# EAGLE schematic TMC5130_3D_Printer_BOARD_V_2 (EAGLE 6.5.0)

## Sheet 1 of 6: I/O
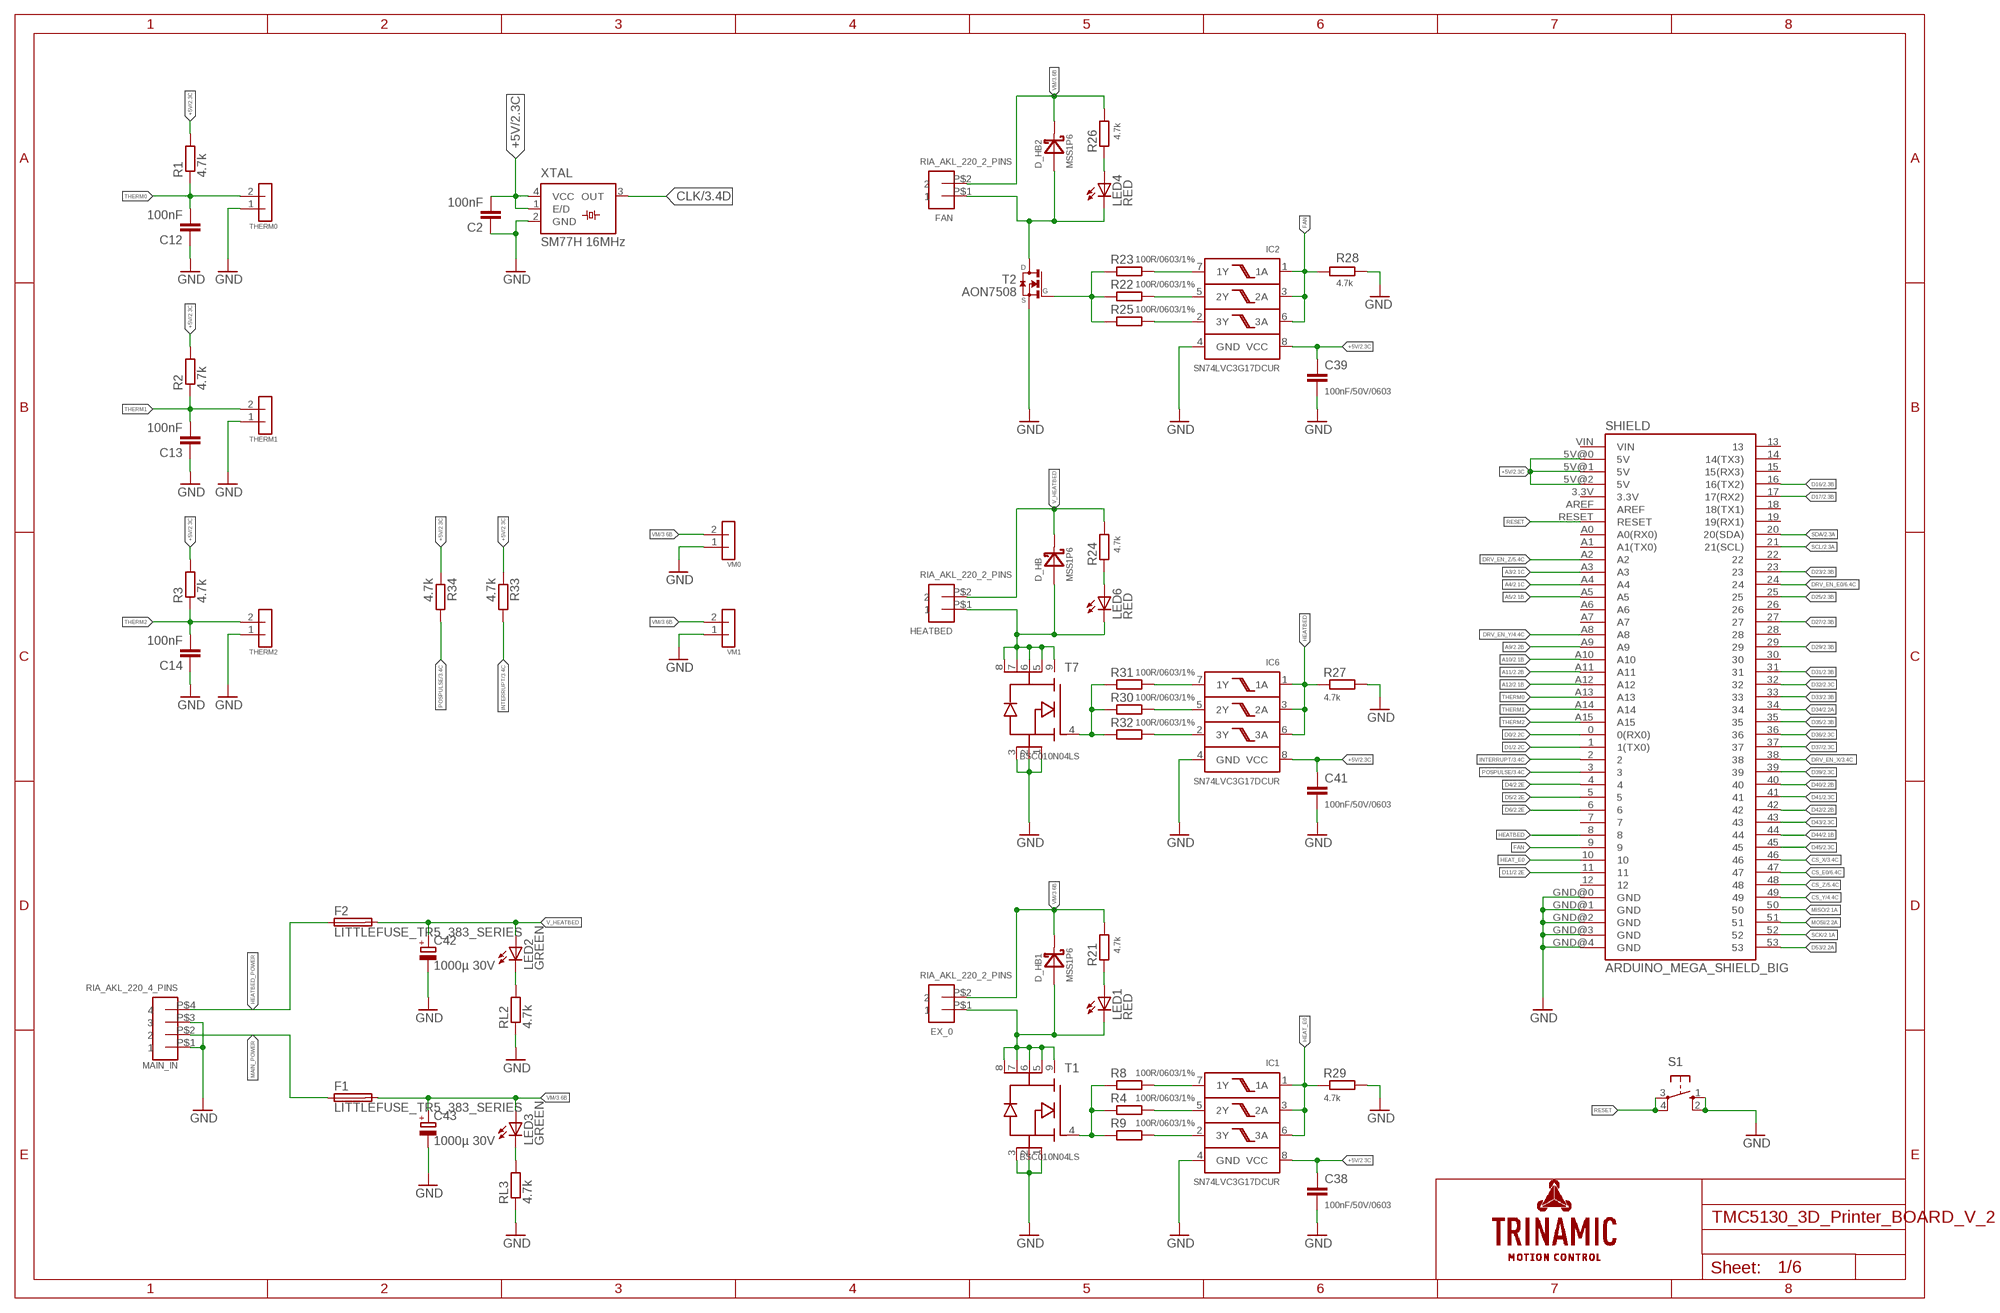
[diagram p0: schematic, sheet 1]

### Parts
C2  100nF  C-EUC0603  [C0603]
C12  100nF  C-EUC0603  [C0603]
C13  100nF  C-EUC0603  [C0603]
C14  100nF  C-EUC0603  [C0603]
C38  100nF/50V/0603  C-EUC0603  [C0603]
C39  100nF/50V/0603  C-EUC0603  [C0603]
C41  100nF/50V/0603  C-EUC0603  [C0603]
C42  1000µ 30V  CPOL-EUE5-10.5  [E5-10,5]
C43  1000µ 30V  CPOL-EUE5-10.5  [E5-10,5]
D_HB  MSS1P6  [MICRO_SMP]
D_HB1  MSS1P6  [MICRO_SMP]
D_HB2  MSS1P6  [MICRO_SMP]
EX_0  RIA_AKL_220_2_PINS  [RIA_AKL_220_2_PINS]
F1  LITTLEFUSE_TR5_383_SERIES  [LITTLEFUSE_TR5_383_SERIES]
F2  LITTLEFUSE_TR5_383_SERIES  [LITTLEFUSE_TR5_383_SERIES]
FAN  RIA_AKL_220_2_PINS  [RIA_AKL_220_2_PINS]
HEATBED  RIA_AKL_220_2_PINS  [RIA_AKL_220_2_PINS]
IC1  SN74LVC3G17DCUR  [US8_DCU]
IC2  SN74LVC3G17DCUR  [US8_DCU]
IC6  SN74LVC3G17DCUR  [US8_DCU]
LED1  RED  LEDCHIPLED_0603  [CHIPLED_0603]
LED2  GREEN  LEDCHIPLED_0603  [CHIPLED_0603]
LED3  GREEN  LEDCHIPLED_0603  [CHIPLED_0603]
LED4  RED  LEDCHIPLED_0603  [CHIPLED_0603]
LED6  RED  LEDCHIPLED_0603  [CHIPLED_0603]
MAIN_IN  RIA_AKL_220_4_PINS  [RIA_AKL_220_4_PINS]
R1  4.7k  R-EU_R0603  [R0603]
R2  4.7k  R-EU_R0603  [R0603]
R3  4.7k  R-EU_R0603  [R0603]
R4  100R/0603/1%  R-EU_R0603  [R0603]
R8  100R/0603/1%  R-EU_R0603  [R0603]
R9  100R/0603/1%  R-EU_R0603  [R0603]
R21  4.7k  R-EU_R0603  [R0603]
R22  100R/0603/1%  R-EU_R0603  [R0603]
R23  100R/0603/1%  R-EU_R0603  [R0603]
R24  4.7k  R-EU_R0603  [R0603]
R25  100R/0603/1%  R-EU_R0603  [R0603]
R26  4.7k  R-EU_R0603  [R0603]
R27  4.7k  R-EU_R0603  [R0603]
R28  4.7k  R-EU_R0603  [R0603]
R29  4.7k  R-EU_R0603  [R0603]
R30  100R/0603/1%  R-EU_R0603  [R0603]
R31  100R/0603/1%  R-EU_R0603  [R0603]
R32  100R/0603/1%  R-EU_R0603  [R0603]
R33  4.7k  R-EU_R0603  [R0603]
R34  4.7k  R-EU_R0603  [R0603]
RL2  4.7k  R-EU_R0603  [R0603]
RL3  4.7k  R-EU_R0603  [R0603]
S1  10-XX  [B3F-10XX]
SHIELD  ARDUINO_MEGA_SHIELD_BIG  [ARDUINO_MEGA_SHIELD]
T1  BSC010N04LS  [PG-TDSON-8FL]
T2  AON7508  [DFN3X3_8L]
T7  BSC010N04LS  [PG-TDSON-8FL]
THERM0  2PIN_1ROW  [2PIN_1ROW_2.54_THT]
THERM1  2PIN_1ROW  [2PIN_1ROW_2.54_THT]
THERM2  2PIN_1ROW  [2PIN_1ROW_2.54_THT]
VM0  2PIN_1ROW  [2PIN_1ROW_2.54_THT]
VM1  2PIN_1ROW  [2PIN_1ROW_2.54_THT]
XTAL  SM77H 16MHz  SM77H  [SM77H]

### Nets
+5V: C2.2 C38.1 C39.1 C41.1 IC1.8(VCC) IC2.8(VCC) IC6.8(VCC) R1.2 R2.2 R3.2 R33.1 R34.1 SHIELD.5V@0(5V) SHIELD.5V@1(5V) SHIELD.5V@2(5V) XTAL.1(E/D) XTAL.4(VCC) ; also sheet 2,3,4,5,6
A3: SHIELD.A3 ; also sheet 2
A4: SHIELD.A4 ; also sheet 2
A5: SHIELD.A5 ; also sheet 2
A9: SHIELD.A9 ; also sheet 2
A10: SHIELD.A10 ; also sheet 2
A11: SHIELD.A11 ; also sheet 2
A12: SHIELD.A12 ; also sheet 2
CLK: XTAL.3(OUT) ; also sheet 3,4,5,6
CS_E0: SHIELD.47 ; also sheet 6
CS_X: SHIELD.46 ; also sheet 3
CS_Y: SHIELD.49 ; also sheet 4
CS_Z: SHIELD.48 ; also sheet 5
D0: SHIELD.0(0(RX0)) ; also sheet 2
D1: SHIELD.1(1(TX0)) ; also sheet 2
D4: SHIELD.4 ; also sheet 2
D5: SHIELD.5 ; also sheet 2
D6: SHIELD.6 ; also sheet 2
D11: SHIELD.11 ; also sheet 2
D16: SHIELD.16(16(TX2)) ; also sheet 2
D17: SHIELD.17(17(RX2)) ; also sheet 2
D23: SHIELD.23 ; also sheet 2
D25: SHIELD.25 ; also sheet 2
D27: SHIELD.27 ; also sheet 2
D29: SHIELD.29 ; also sheet 2
D31: SHIELD.31 ; also sheet 2
D32: SHIELD.32 ; also sheet 2
D33: SHIELD.33 ; also sheet 2
D34: SHIELD.34 ; also sheet 2
D35: SHIELD.35 ; also sheet 2
D36: SHIELD.36 ; also sheet 2
D37: SHIELD.37 ; also sheet 2
D39: SHIELD.39 ; also sheet 2
D40: SHIELD.40 ; also sheet 2
D41: SHIELD.41 ; also sheet 2
D42: SHIELD.42 ; also sheet 2
D43: SHIELD.43 ; also sheet 2
D44: SHIELD.44 ; also sheet 2
D45: SHIELD.45 ; also sheet 2
D53: SHIELD.53 ; also sheet 2
DRV_EN_E0: SHIELD.24 ; also sheet 6
DRV_EN_X: SHIELD.38 ; also sheet 3
DRV_EN_Y: SHIELD.A8 ; also sheet 4
DRV_EN_Z: SHIELD.A2 ; also sheet 5
FAN: IC2.1(1A) IC2.3(2A) IC2.6(3A) R28.1 SHIELD.9
GND: C2.1 C12.1 C13.1 C14.1 C38.2 C39.2 C41.2 C42.- C43.- IC1.4(GND) IC2.4(GND) IC6.4(GND) MAIN_IN.P$1 MAIN_IN.P$3 R27.2 R28.2 R29.2 RL2.1 RL3.1 S1.1(S) S1.2(S1) SHIELD.GND@0(GND) SHIELD.GND@1(GND) SHIELD.GND@2(GND) SHIELD.GND@3(GND) SHIELD.GND@4(GND) T1.1 T1.2 T1.3 T2.S0(S) T2.S1(S) T2.S2(S) T7.1 T7.2 T7.3 THERM0.1 THERM1.1 THERM2.1 VM0.1 VM1.1 XTAL.2(GND) ; also sheet 2,3,4,5,6
HEAT_E0: IC1.1(1A) IC1.3(2A) IC1.6(3A) R29.1 SHIELD.10
HEATBED: IC6.1(1A) IC6.3(2A) IC6.6(3A) R27.1 SHIELD.8
HEATBED_POWER: F2.P$1 MAIN_IN.P$4
INTERRUPT: R33.2 SHIELD.2 ; also sheet 3,4,5,6
MAIN_POWER: F1.P$1 MAIN_IN.P$2
MISO: SHIELD.50 ; also sheet 2,3,4,5,6
MOSI: SHIELD.51 ; also sheet 2,3,4,5,6
N$24: LED3.C RL3.2
N$25: LED2.C RL2.2
N$26: LED6.A R24.1
N$27: D_HB1.A EX_0.P$1 LED1.C T1.5 T1.6 T1.7 T1.8 T1.9
N$28: R4.1 R8.1 R9.1 T1.4
N$29: IC1.7(1Y) R8.2
N$30: IC1.5(2Y) R4.2
N$31: IC1.2(3Y) R9.2
N$32: LED1.A R21.1
N$36: D_HB2.A FAN.P$1 LED4.C T2.D0(D) T2.D1(D) T2.D2(D) T2.D3(D) T2.D4(D) T2.D5(D) T2.D6(D)
N$37: R22.1 R23.1 R25.1 T2.G
N$38: D_HB.A HEATBED.P$1 LED6.C T7.5 T7.6 T7.7 T7.8 T7.9
N$39: R30.1 R31.1 R32.1 T7.4
N$40: IC2.7(1Y) R23.2
N$41: IC2.5(2Y) R22.2
N$42: IC6.7(1Y) R31.2
N$43: IC6.5(2Y) R30.2
N$44: IC6.2(3Y) R32.2
N$45: IC2.2(3Y) R25.2
N$46: LED4.A R26.1
POSPULSE: R34.2 SHIELD.3 ; also sheet 3,4,5,6
RESET: S1.3(P) S1.4(P1) SHIELD.RESET
SCK: SHIELD.52 ; also sheet 2,3,4,5,6
SCL: SHIELD.21(21(SCL)) ; also sheet 2
SDA: SHIELD.20(20(SDA)) ; also sheet 2
THERM0: C12.2 R1.1 SHIELD.A13 THERM0.2
THERM1: C13.2 R2.1 SHIELD.A14 THERM1.2
THERM2: C14.2 R3.1 SHIELD.A15 THERM2.2
V_HEATBED: C42.+ D_HB.C F2.P$2 HEATBED.P$2 LED2.A R24.2
VM: C43.+ D_HB1.C D_HB2.C EX_0.P$2 F1.P$2 FAN.P$2 LED3.A R21.2 R26.2 VM0.2 VM1.2 ; also sheet 3,4,5,6
Unconnected: SHIELD.3.3V SHIELD.7 SHIELD.12 SHIELD.13 SHIELD.14(14(TX3)) SHIELD.15(15(RX3)) SHIELD.18(18(TX1)) SHIELD.19(19(RX1)) SHIELD.22 SHIELD.26 SHIELD.28 SHIELD.30 SHIELD.A0(A0(RX0)) SHIELD.A1(A1(TX0)) SHIELD.A6 SHIELD.A7 SHIELD.AREF SHIELD.VIN

## Sheet 2 of 6
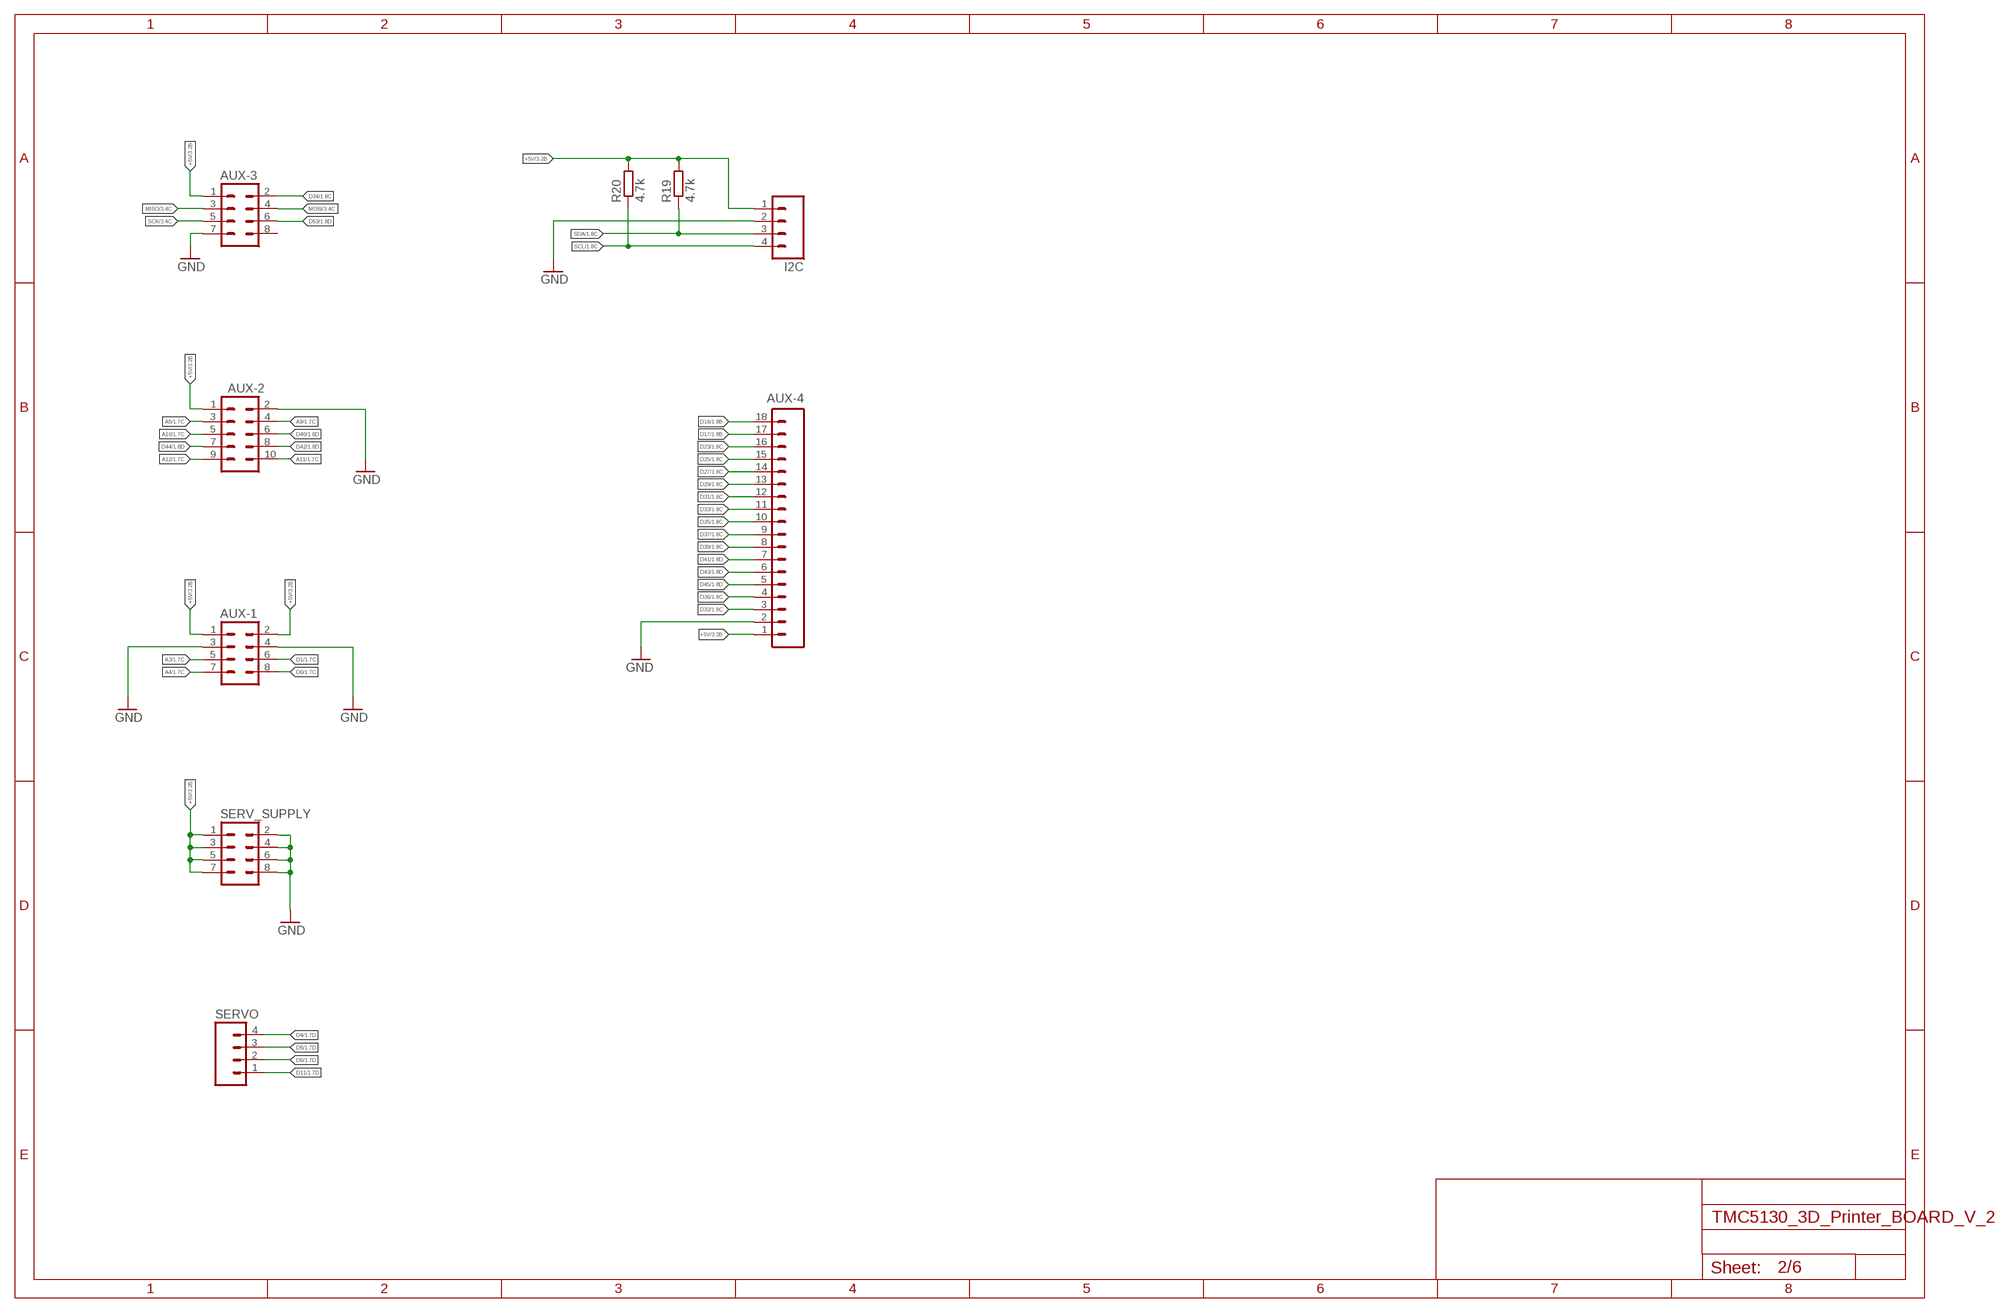
[diagram p1: schematic, sheet 2]

### Parts
AUX-1  M04X2  [2X4]
AUX-2  M05X2PTH  [AVR_ICSP]
AUX-3  M04X2  [2X4]
AUX-4  M18_  [1X18]
I2C  M04PTH  [1X04]
R19  4.7k  R-EU_R0603  [R0603]
R20  4.7k  R-EU_R0603  [R0603]
SERV_SUPPLY  M04X2  [2X4]
SERVO  M04PTH  [1X04]

### Nets
+5V: AUX-1.1 AUX-1.2 AUX-2.1 AUX-3.1 AUX-4.1 I2C.1 R19.2 R20.2 SERV_SUPPLY.1 SERV_SUPPLY.3 SERV_SUPPLY.5 SERV_SUPPLY.7 ; also sheet 1,3,4,5,6
A3: AUX-1.5 ; also sheet 1
A4: AUX-1.7 ; also sheet 1
A5: AUX-2.3 ; also sheet 1
A9: AUX-2.4 ; also sheet 1
A10: AUX-2.5 ; also sheet 1
A11: AUX-2.10 ; also sheet 1
A12: AUX-2.9 ; also sheet 1
D0: AUX-1.8 ; also sheet 1
D1: AUX-1.6 ; also sheet 1
D4: SERVO.4 ; also sheet 1
D5: SERVO.3 ; also sheet 1
D6: SERVO.2 ; also sheet 1
D11: SERVO.1 ; also sheet 1
D16: AUX-4.18 ; also sheet 1
D17: AUX-4.17 ; also sheet 1
D23: AUX-4.16 ; also sheet 1
D25: AUX-4.15 ; also sheet 1
D27: AUX-4.14 ; also sheet 1
D29: AUX-4.13 ; also sheet 1
D31: AUX-4.12 ; also sheet 1
D32: AUX-4.3 ; also sheet 1
D33: AUX-4.11 ; also sheet 1
D34: AUX-3.2 ; also sheet 1
D35: AUX-4.10 ; also sheet 1
D36: AUX-4.4 ; also sheet 1
D37: AUX-4.9 ; also sheet 1
D39: AUX-4.8 ; also sheet 1
D40: AUX-2.6 ; also sheet 1
D41: AUX-4.7 ; also sheet 1
D42: AUX-2.8 ; also sheet 1
D43: AUX-4.6 ; also sheet 1
D44: AUX-2.7 ; also sheet 1
D45: AUX-4.5 ; also sheet 1
D53: AUX-3.6 ; also sheet 1
GND: AUX-1.3 AUX-1.4 AUX-2.2 AUX-3.7 AUX-4.2 I2C.2 SERV_SUPPLY.2 SERV_SUPPLY.4 SERV_SUPPLY.6 SERV_SUPPLY.8 ; also sheet 1,3,4,5,6
MISO: AUX-3.3 ; also sheet 1,3,4,5,6
MOSI: AUX-3.4 ; also sheet 1,3,4,5,6
SCK: AUX-3.5 ; also sheet 1,3,4,5,6
SCL: I2C.4 R20.1 ; also sheet 1
SDA: I2C.3 R19.1 ; also sheet 1
Unconnected: AUX-3.8

## Sheet 3 of 6: X_AXIS
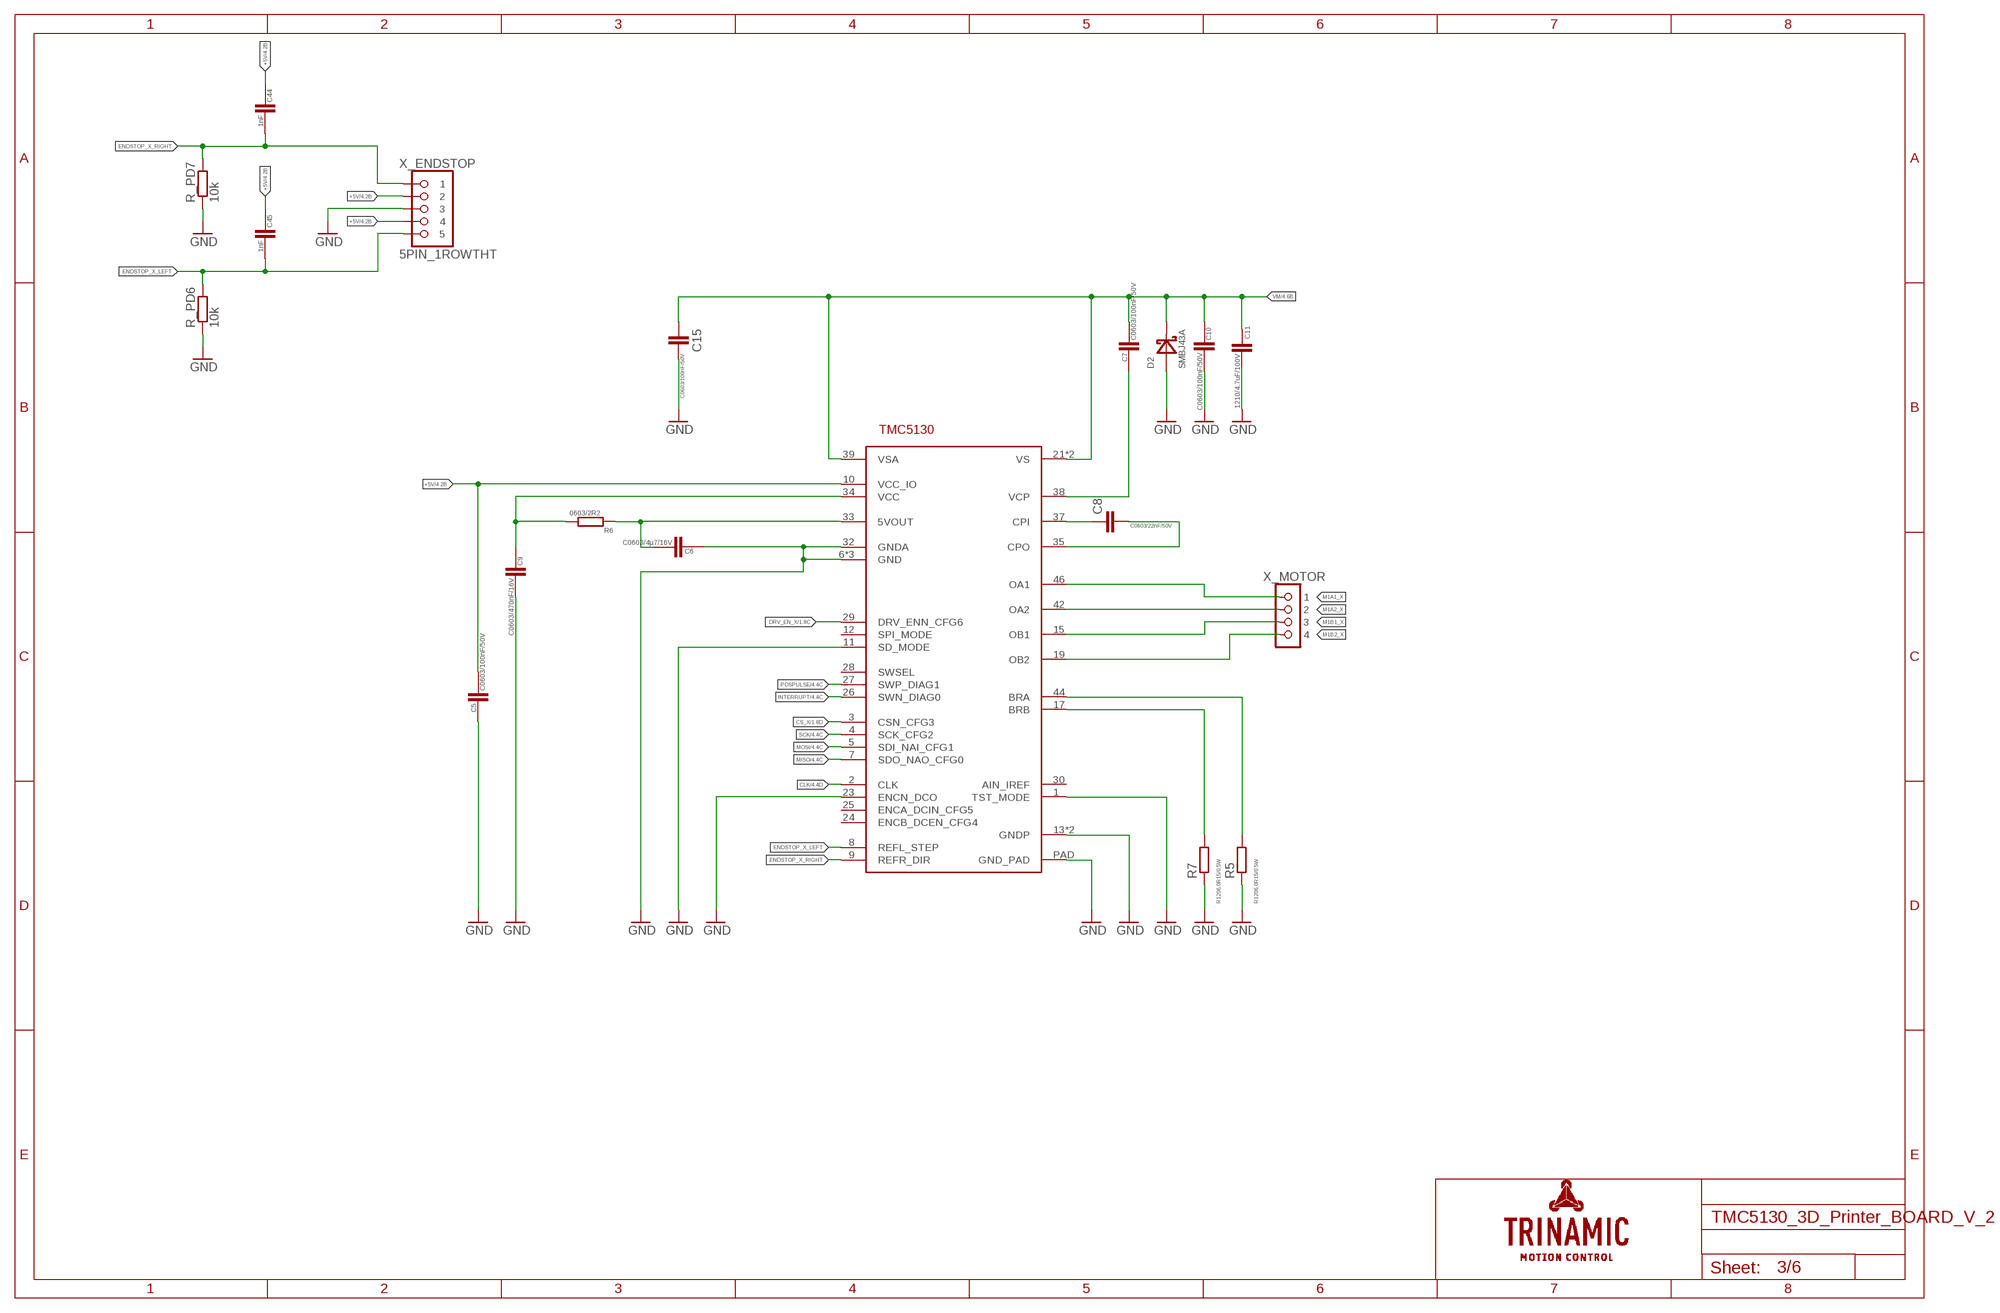
[diagram p2: schematic, sheet 3]

### Parts
C5  C0603/100nF/50V  C/0603  [0603]
C6  C0603/4µ7/16V  C/0603  [0603]
C7  C0603/100nF/50V  C/0603  [0603]
C8  C0603/22nF/50V  C-EUC0603  [C0603]
C9  C0603/470nF/16V  C/0603  [0603]
C10  C0603/100nF/50V  C/0603  [0603]
C11  1210/4.7uF/100V  C-EUC1210  [C1210]
C15  C0603/100nF/50V  C-EUC0603  [C0603]
C44  1nF  C/0603  [0603]
C45  1nF  C/0603  [0603]
D2  SMBJ43A  SMBJ  [SMB]
R5  R1206,0R15/0.5W  R-EU_R1206  [R1206]
R6  0603/2R2  R/0603  [0603]
R7  R1206,0R15/0.5W  R-EU_R1206  [R1206]
R_PD6  10k  R-EU_R0603  [R0603]
R_PD7  10k  R-EU_R0603  [R0603]
TMC5130  TMC5130  [QFP50P900X900X113-49N_NOFID]
X_ENDSTOP  5PIN_1ROWTHT  [5PIN_1ROW_2.54_THT]
X_MOTOR  4PIN_1ROWTHT  [4PIN_1ROW_2.54_THT]

### Nets
+5V: C5.1 C44.2 C45.2 TMC5130.10(VCC_IO) X_ENDSTOP.2 X_ENDSTOP.4 ; also sheet 1,2,4,5,6
CLK: TMC5130.2(CLK) ; also sheet 1,4,5,6
CS_X: TMC5130.3(CSN_CFG3) ; also sheet 1
DRV_EN_X: TMC5130.29(DRV_ENN_CFG6) ; also sheet 1
ENDSTOP_X_LEFT: C45.1 R_PD6.2 TMC5130.8(REFL_STEP) X_ENDSTOP.5
ENDSTOP_X_RIGHT: C44.1 R_PD7.2 TMC5130.9(REFR_DIR) X_ENDSTOP.1
GND: C5.2 C6.2 C9.1 C10.1 C11.2 C15.1 D2.A R5.1 R7.1 R_PD6.1 R_PD7.1 TMC5130.1(TST_MODE) TMC5130.6(GND) TMC5130.11(SD_MODE) TMC5130.13(GNDP) TMC5130.23(ENCN_DCO) TMC5130.31(GND) TMC5130.32(GNDA) TMC5130.36(GND) TMC5130.48(GNDP) TMC5130.PAD(GND_PAD) X_ENDSTOP.3 ; also sheet 1,2,4,5,6
INTERRUPT: TMC5130.26(SWN_DIAG0) ; also sheet 1,4,5,6
M1A1_X: TMC5130.46(OA1) X_MOTOR.1
M1A2_X: TMC5130.42(OA2) X_MOTOR.2
M1B1_X: TMC5130.15(OB1) X_MOTOR.3
M1B2_X: TMC5130.19(OB2) X_MOTOR.4
MISO: TMC5130.7(SDO_NAO_CFG0) ; also sheet 1,2,4,5,6
MOSI: TMC5130.5(SDI_NAI_CFG1) ; also sheet 1,2,4,5,6
N$7: C6.1 R6.1 TMC5130.33(5VOUT)
N$8: C8.1 TMC5130.37(CPI)
N$9: C8.2 TMC5130.35(CPO)
N$10: C7.2 TMC5130.38(VCP)
N$11: C9.2 R6.2 TMC5130.34(VCC)
POSPULSE: TMC5130.27(SWP_DIAG1) ; also sheet 1,4,5,6
SCK: TMC5130.4(SCK_CFG2) ; also sheet 1,2,4,5,6
SENSE1: R5.2 TMC5130.44(BRA)
SENSE2: R7.2 TMC5130.17(BRB)
VM: C7.1 C10.2 C11.1 C15.2 D2.C TMC5130.21(VS) TMC5130.39(VSA) TMC5130.40(VS) ; also sheet 1,4,5,6
Unconnected: TMC5130.12(SPI_MODE) TMC5130.24(ENCB_DCEN_CFG4) TMC5130.25(ENCA_DCIN_CFG5) TMC5130.28(SWSEL) TMC5130.30(AIN_IREF)

## Sheet 4 of 6: Y_AXIS
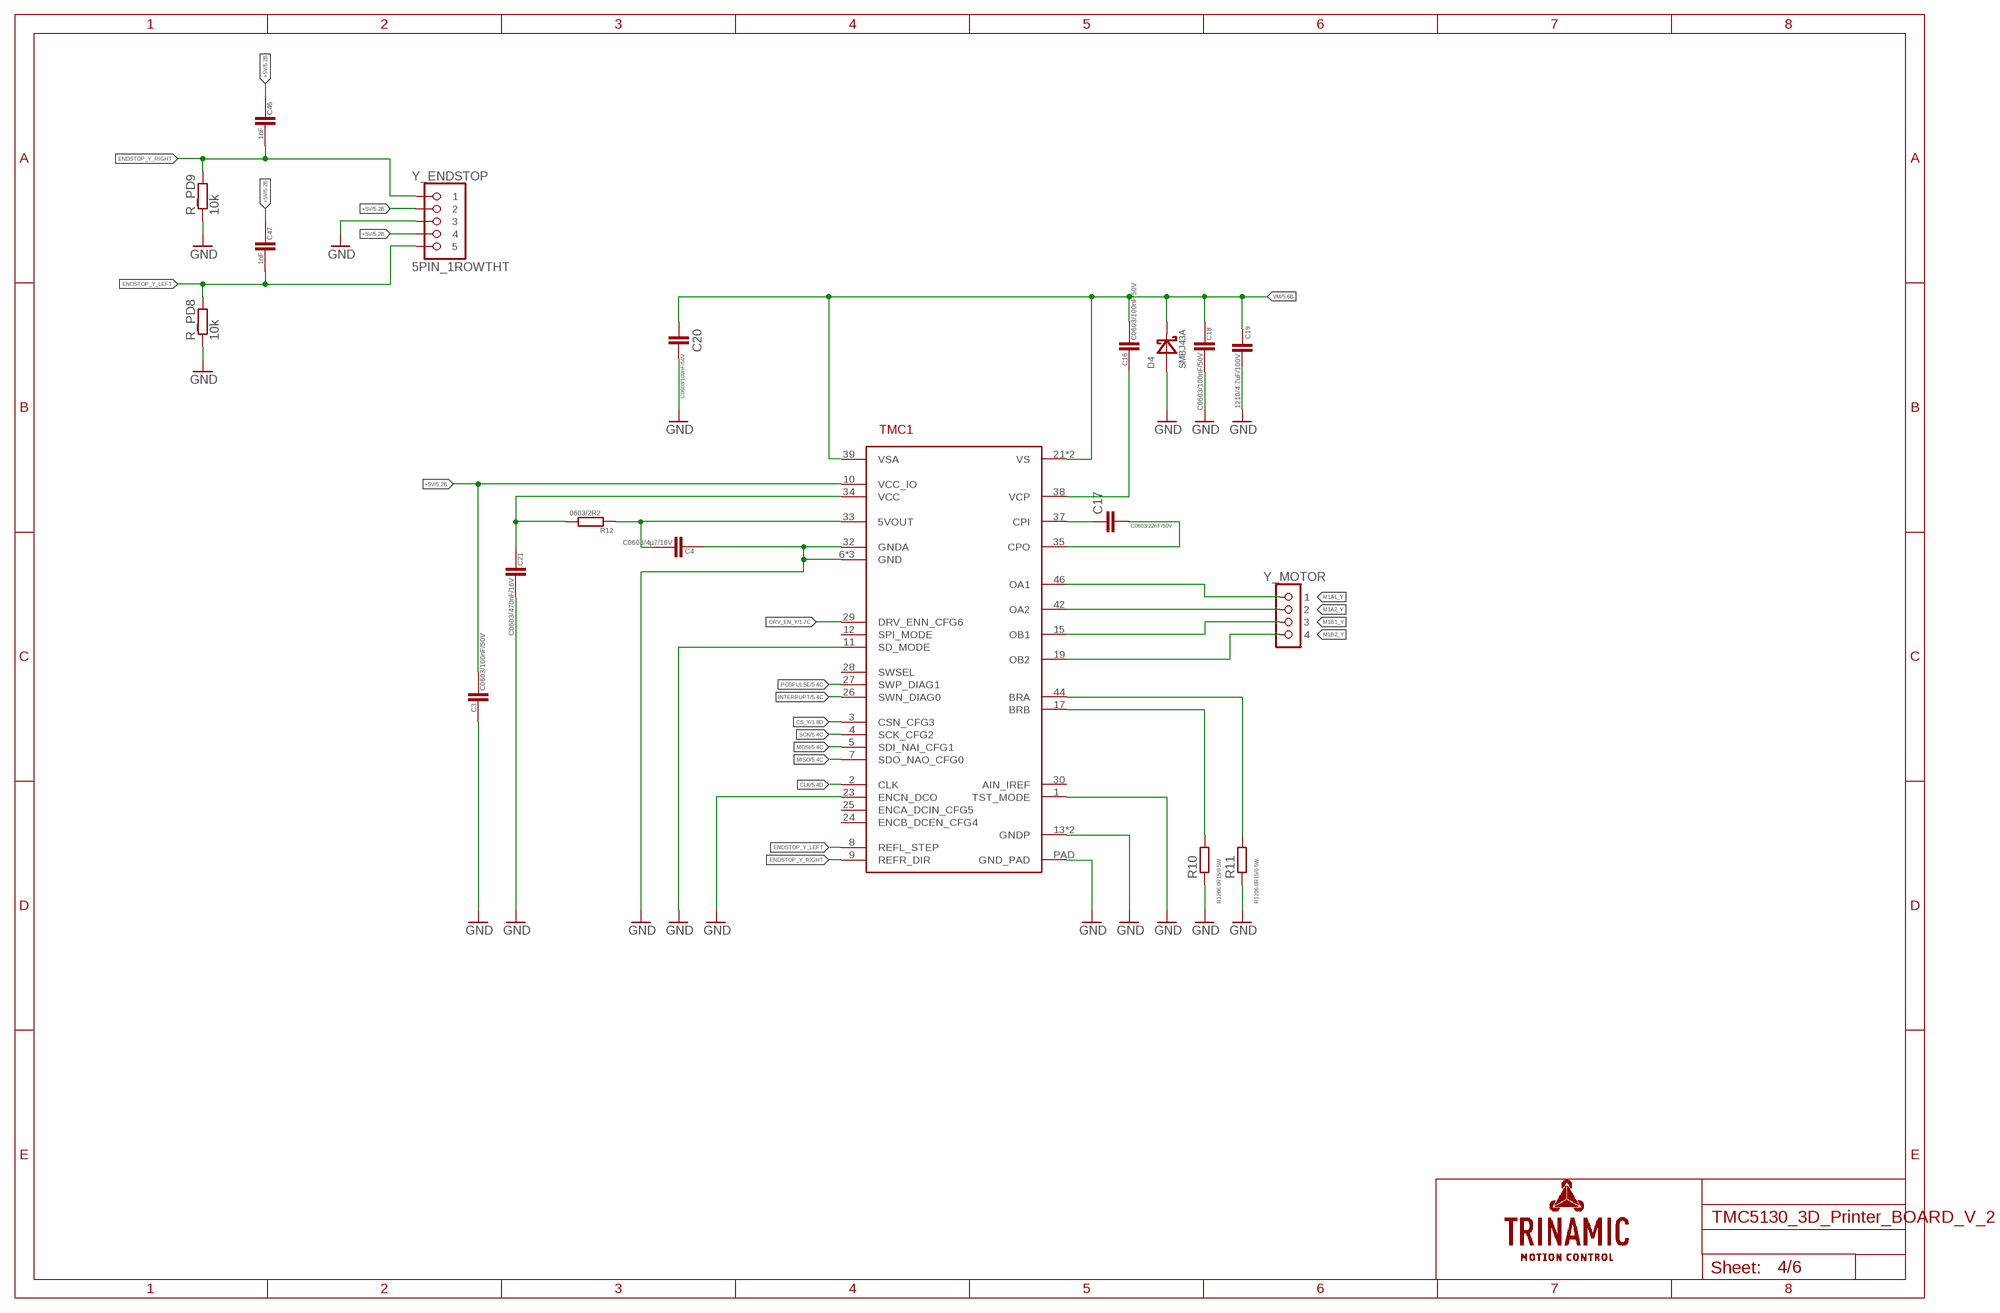
[diagram p3: schematic, sheet 4]

### Parts
C3  C0603/100nF/50V  C/0603  [0603]
C4  C0603/4µ7/16V  C/0603  [0603]
C16  C0603/100nF/50V  C/0603  [0603]
C17  C0603/22nF/50V  C-EUC0603  [C0603]
C18  C0603/100nF/50V  C/0603  [0603]
C19  1210/4.7uF/100V  C-EUC1210  [C1210]
C20  C0603/100nF/50V  C-EUC0603  [C0603]
C21  C0603/470nF/16V  C/0603  [0603]
C46  1nF  C/0603  [0603]
C47  1nF  C/0603  [0603]
D4  SMBJ43A  SMBJ  [SMB]
R10  R1206,0R15/0.5W  R-EU_R1206  [R1206]
R11  R1206,0R15/0.5W  R-EU_R1206  [R1206]
R12  0603/2R2  R/0603  [0603]
R_PD8  10k  R-EU_R0603  [R0603]
R_PD9  10k  R-EU_R0603  [R0603]
TMC1  TMC5130  [QFP50P900X900X113-49N_NOFID]
Y_ENDSTOP  5PIN_1ROWTHT  [5PIN_1ROW_2.54_THT]
Y_MOTOR  4PIN_1ROWTHT  [4PIN_1ROW_2.54_THT]

### Nets
+5V: C3.1 C46.2 C47.2 TMC1.10(VCC_IO) Y_ENDSTOP.2 Y_ENDSTOP.4 ; also sheet 1,2,3,5,6
CLK: TMC1.2(CLK) ; also sheet 1,3,5,6
CS_Y: TMC1.3(CSN_CFG3) ; also sheet 1
DRV_EN_Y: TMC1.29(DRV_ENN_CFG6) ; also sheet 1
ENDSTOP_Y_LEFT: C47.1 R_PD8.2 TMC1.8(REFL_STEP) Y_ENDSTOP.5
ENDSTOP_Y_RIGHT: C46.1 R_PD9.2 TMC1.9(REFR_DIR) Y_ENDSTOP.1
GND: C3.2 C4.2 C18.1 C19.2 C20.1 C21.1 D4.A R10.1 R11.1 R_PD8.1 R_PD9.1 TMC1.1(TST_MODE) TMC1.6(GND) TMC1.11(SD_MODE) TMC1.13(GNDP) TMC1.23(ENCN_DCO) TMC1.31(GND) TMC1.32(GNDA) TMC1.36(GND) TMC1.48(GNDP) TMC1.PAD(GND_PAD) Y_ENDSTOP.3 ; also sheet 1,2,3,5,6
INTERRUPT: TMC1.26(SWN_DIAG0) ; also sheet 1,3,5,6
M1A1_Y: TMC1.46(OA1) Y_MOTOR.1
M1A2_Y: TMC1.42(OA2) Y_MOTOR.2
M1B1_Y: TMC1.15(OB1) Y_MOTOR.3
M1B2_Y: TMC1.19(OB2) Y_MOTOR.4
MISO: TMC1.7(SDO_NAO_CFG0) ; also sheet 1,2,3,5,6
MOSI: TMC1.5(SDI_NAI_CFG1) ; also sheet 1,2,3,5,6
N$4: C17.1 TMC1.37(CPI)
N$5: C17.2 TMC1.35(CPO)
N$6: C16.2 TMC1.38(VCP)
N$12: C21.2 R12.2 TMC1.34(VCC)
N$13: C4.1 R12.1 TMC1.33(5VOUT)
POSPULSE: TMC1.27(SWP_DIAG1) ; also sheet 1,3,5,6
SCK: TMC1.4(SCK_CFG2) ; also sheet 1,2,3,5,6
SENSE3: R10.2 TMC1.17(BRB)
SENSE4: R11.2 TMC1.44(BRA)
VM: C16.1 C18.2 C19.1 C20.2 D4.C TMC1.21(VS) TMC1.39(VSA) TMC1.40(VS) ; also sheet 1,3,5,6
Unconnected: TMC1.12(SPI_MODE) TMC1.24(ENCB_DCEN_CFG4) TMC1.25(ENCA_DCIN_CFG5) TMC1.28(SWSEL) TMC1.30(AIN_IREF)

## Sheet 5 of 6: Z_AXIS
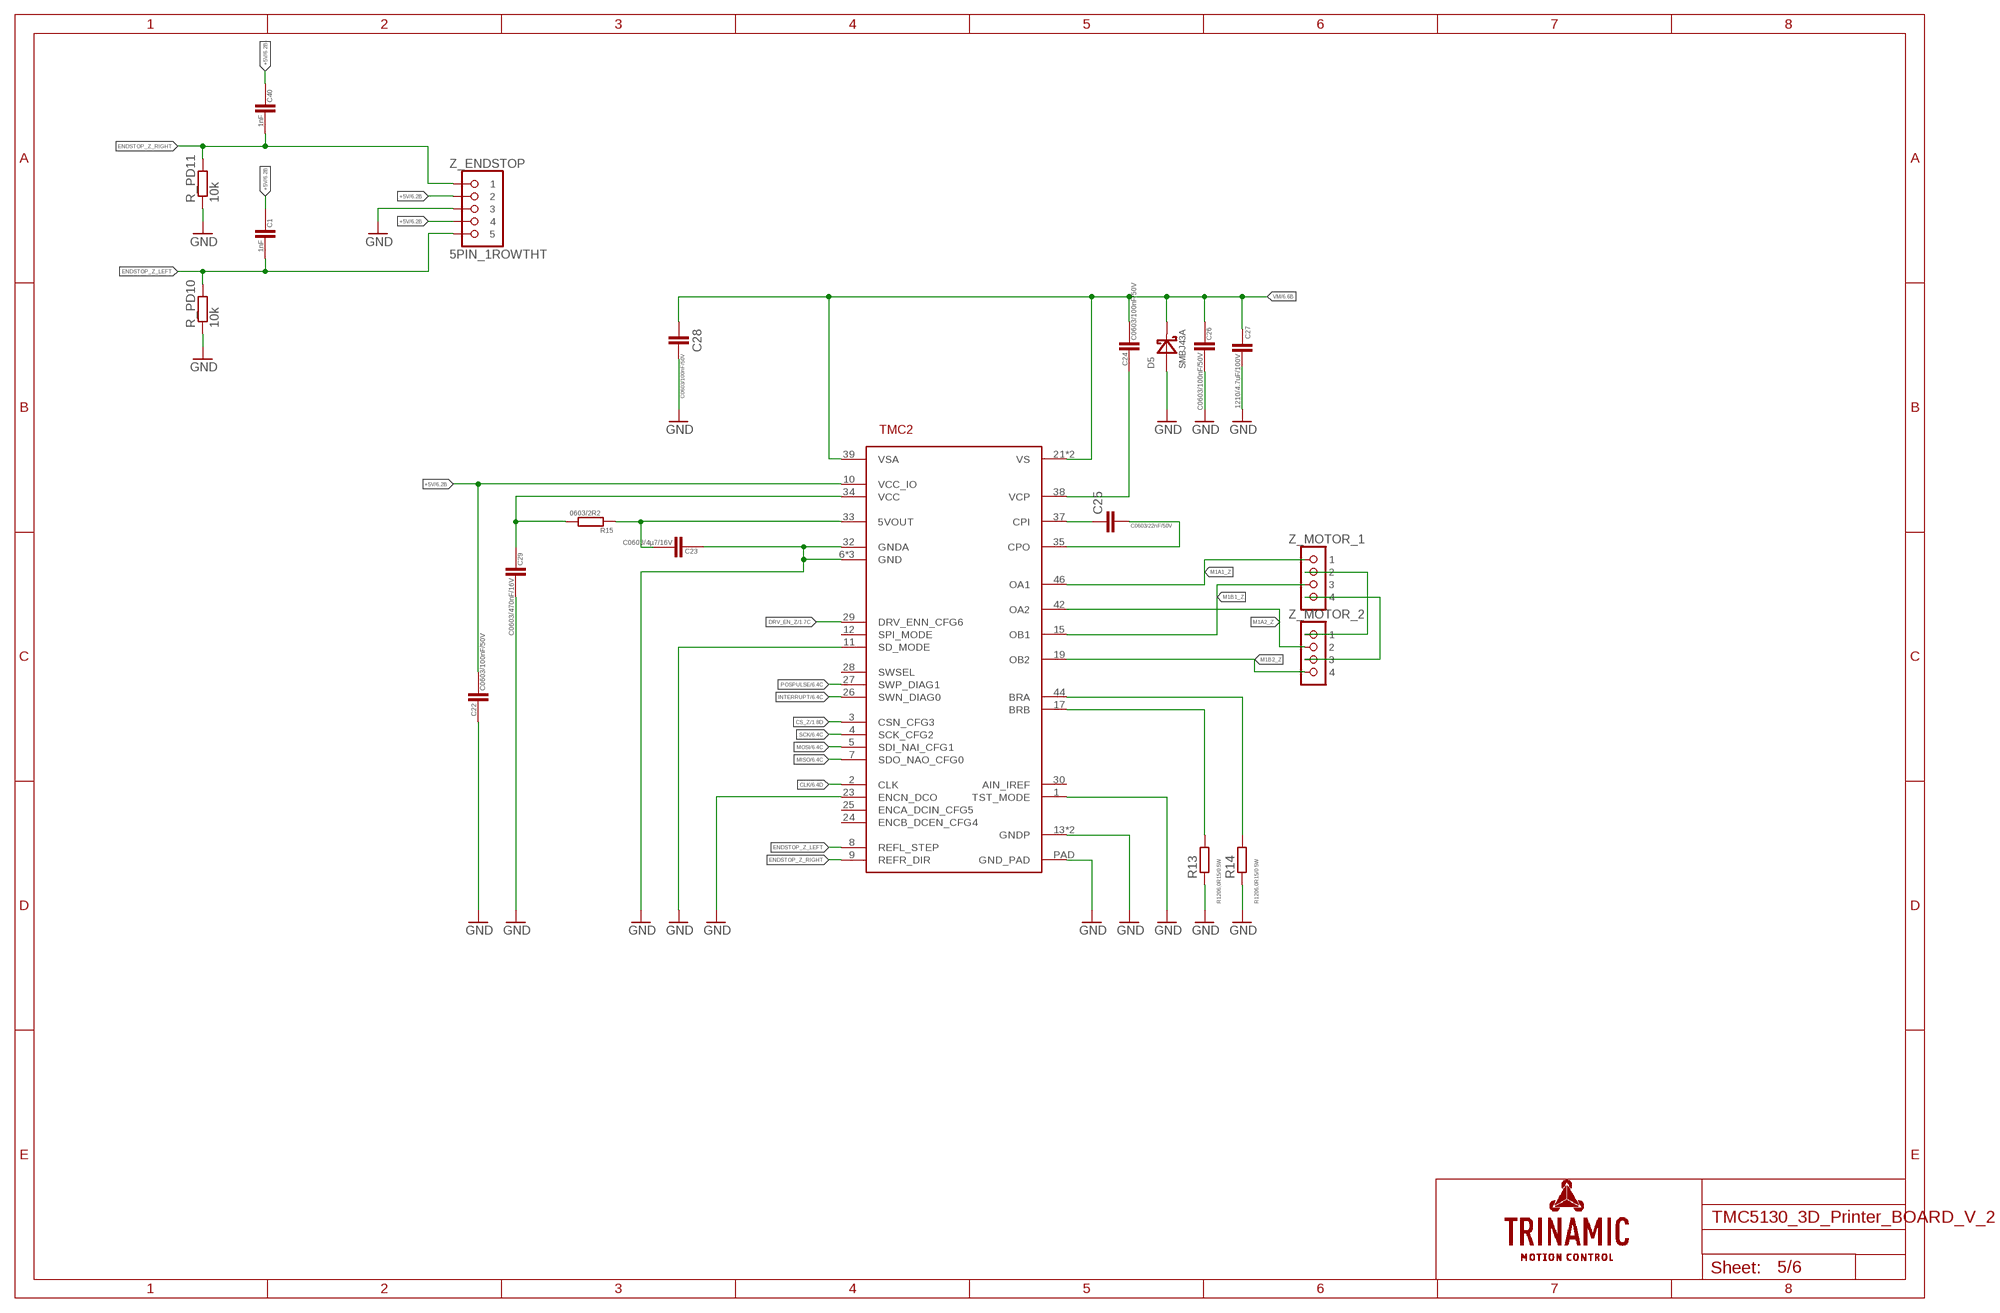
[diagram p4: schematic, sheet 5]

### Parts
C1  1nF  C/0603  [0603]
C22  C0603/100nF/50V  C/0603  [0603]
C23  C0603/4µ7/16V  C/0603  [0603]
C24  C0603/100nF/50V  C/0603  [0603]
C25  C0603/22nF/50V  C-EUC0603  [C0603]
C26  C0603/100nF/50V  C/0603  [0603]
C27  1210/4.7uF/100V  C-EUC1210  [C1210]
C28  C0603/100nF/50V  C-EUC0603  [C0603]
C29  C0603/470nF/16V  C/0603  [0603]
C40  1nF  C/0603  [0603]
D5  SMBJ43A  SMBJ  [SMB]
R13  R1206,0R15/0.5W  R-EU_R1206  [R1206]
R14  R1206,0R15/0.5W  R-EU_R1206  [R1206]
R15  0603/2R2  R/0603  [0603]
R_PD10  10k  R-EU_R0603  [R0603]
R_PD11  10k  R-EU_R0603  [R0603]
TMC2  TMC5130  [QFP50P900X900X113-49N_NOFID]
Z_ENDSTOP  5PIN_1ROWTHT  [5PIN_1ROW_2.54_THT]
Z_MOTOR_1  4PIN_1ROWTHT  [4PIN_1ROW_2.54_THT]
Z_MOTOR_2  4PIN_1ROWTHT  [4PIN_1ROW_2.54_THT]

### Nets
+5V: C1.2 C22.1 C40.2 TMC2.10(VCC_IO) Z_ENDSTOP.2 Z_ENDSTOP.4 ; also sheet 1,2,3,4,6
CLK: TMC2.2(CLK) ; also sheet 1,3,4,6
CS_Z: TMC2.3(CSN_CFG3) ; also sheet 1
DRV_EN_Z: TMC2.29(DRV_ENN_CFG6) ; also sheet 1
ENDSTOP_Z_LEFT: C1.1 R_PD10.2 TMC2.8(REFL_STEP) Z_ENDSTOP.5
ENDSTOP_Z_RIGHT: C40.1 R_PD11.2 TMC2.9(REFR_DIR) Z_ENDSTOP.1
GND: C22.2 C23.2 C26.1 C27.2 C28.1 C29.1 D5.A R13.1 R14.1 R_PD10.1 R_PD11.1 TMC2.1(TST_MODE) TMC2.6(GND) TMC2.11(SD_MODE) TMC2.13(GNDP) TMC2.23(ENCN_DCO) TMC2.31(GND) TMC2.32(GNDA) TMC2.36(GND) TMC2.48(GNDP) TMC2.PAD(GND_PAD) Z_ENDSTOP.3 ; also sheet 1,2,3,4,6
INTERRUPT: TMC2.26(SWN_DIAG0) ; also sheet 1,3,4,6
M1A1_Z: TMC2.46(OA1) Z_MOTOR_1.1
M1A2_Z: TMC2.42(OA2) Z_MOTOR_2.2
M1B1_Z: TMC2.15(OB1) Z_MOTOR_1.3
M1B2_Z: TMC2.19(OB2) Z_MOTOR_2.4
MISO: TMC2.7(SDO_NAO_CFG0) ; also sheet 1,2,3,4,6
MOSI: TMC2.5(SDI_NAI_CFG1) ; also sheet 1,2,3,4,6
N$1: Z_MOTOR_1.2 Z_MOTOR_2.1
N$3: Z_MOTOR_1.4 Z_MOTOR_2.3
N$14: C25.1 TMC2.37(CPI)
N$15: C25.2 TMC2.35(CPO)
N$16: C24.2 TMC2.38(VCP)
N$17: C29.2 R15.2 TMC2.34(VCC)
N$18: C23.1 R15.1 TMC2.33(5VOUT)
POSPULSE: TMC2.27(SWP_DIAG1) ; also sheet 1,3,4,6
SCK: TMC2.4(SCK_CFG2) ; also sheet 1,2,3,4,6
SENSE5: R13.2 TMC2.17(BRB)
SENSE6: R14.2 TMC2.44(BRA)
VM: C24.1 C26.2 C27.1 C28.2 D5.C TMC2.21(VS) TMC2.39(VSA) TMC2.40(VS) ; also sheet 1,3,4,6
Unconnected: TMC2.12(SPI_MODE) TMC2.24(ENCB_DCEN_CFG4) TMC2.25(ENCA_DCIN_CFG5) TMC2.28(SWSEL) TMC2.30(AIN_IREF)

## Sheet 6 of 6: E0_AXIS
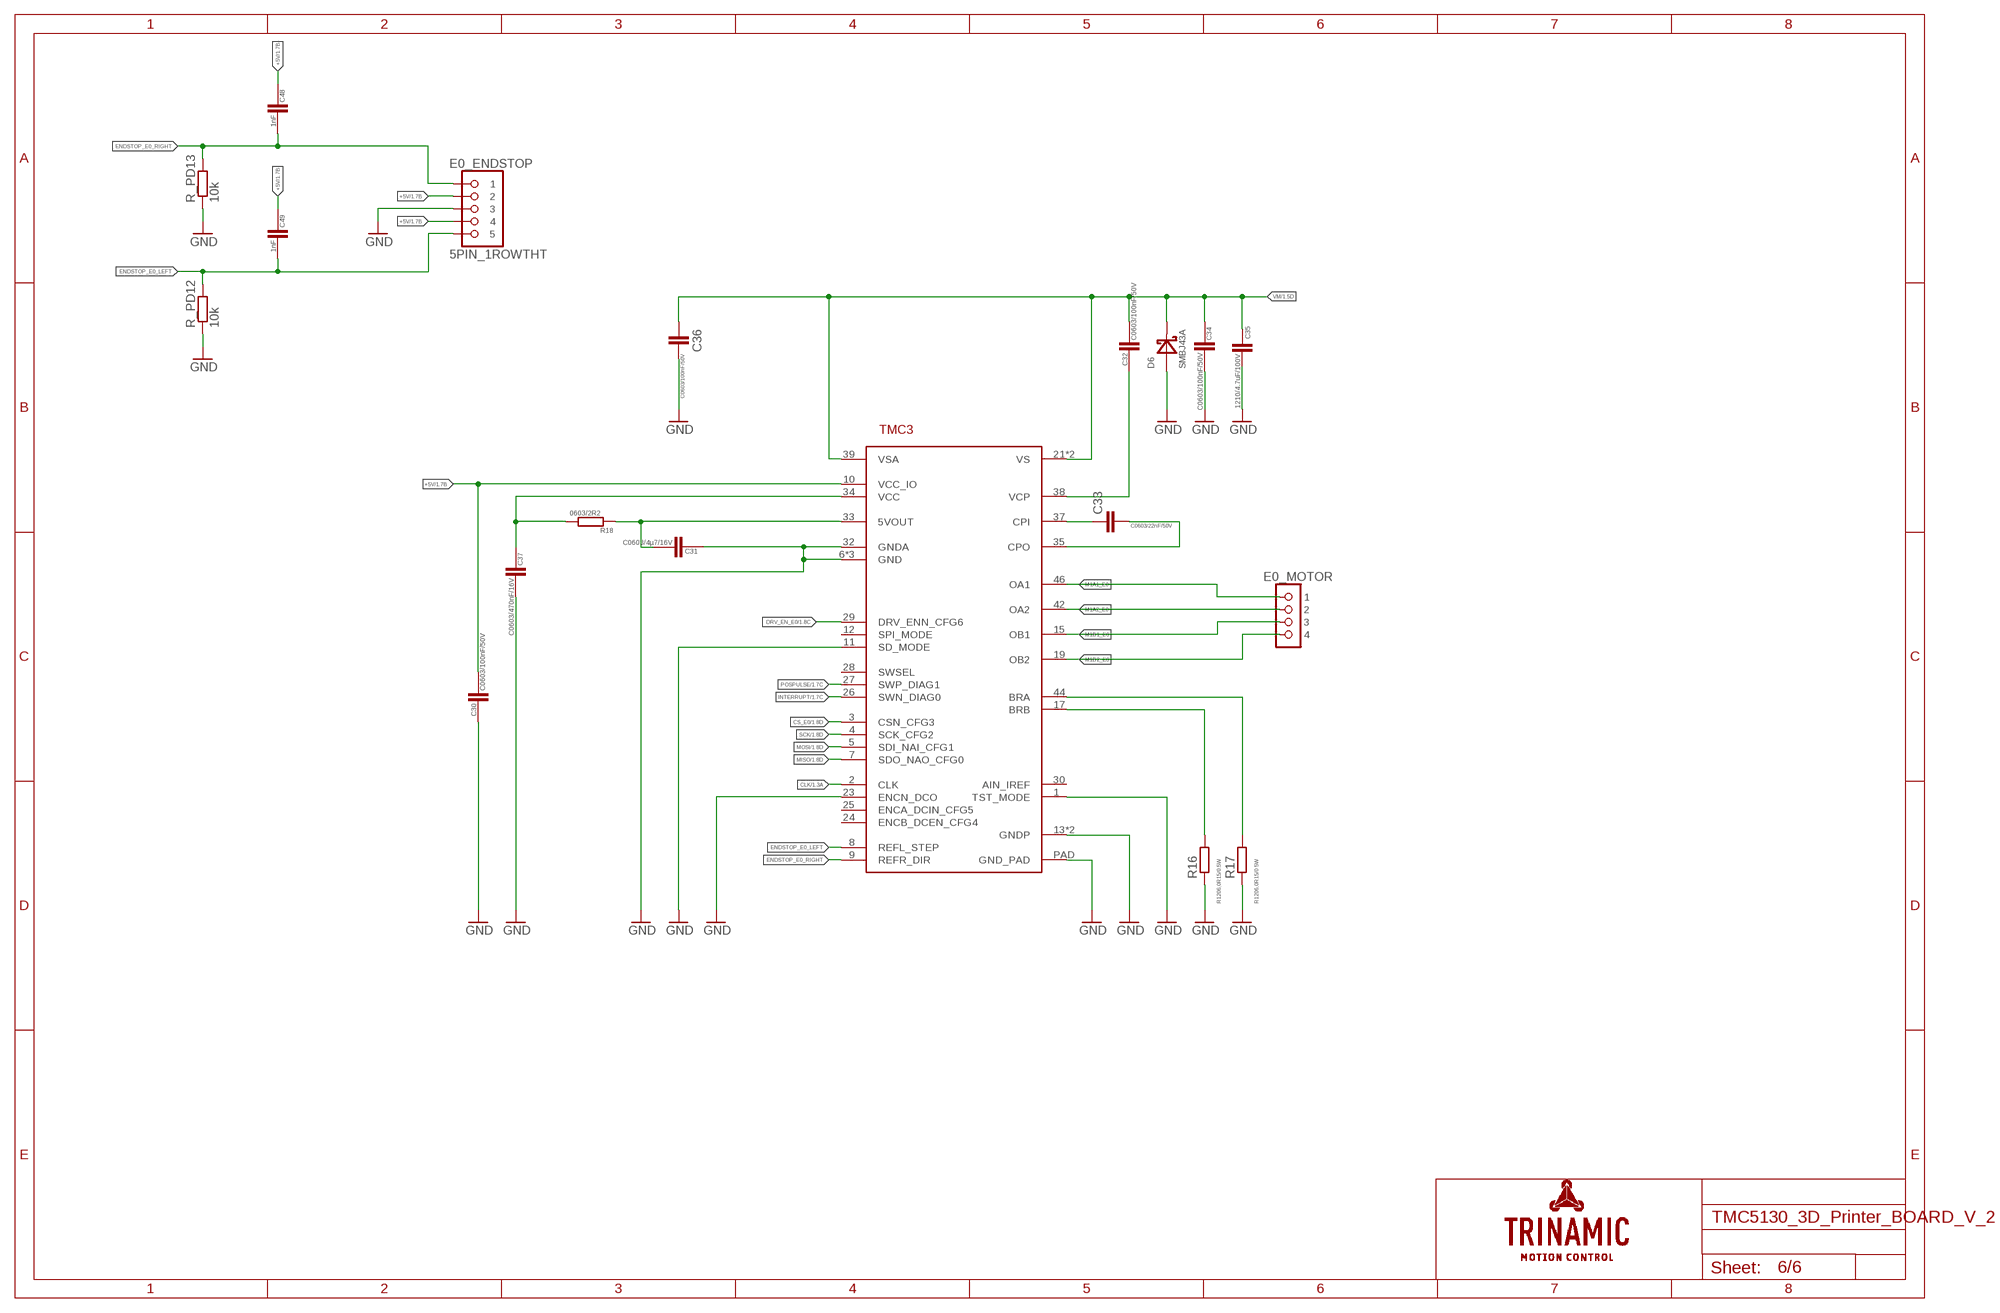
[diagram p5: schematic, sheet 6]

### Parts
C30  C0603/100nF/50V  C/0603  [0603]
C31  C0603/4µ7/16V  C/0603  [0603]
C32  C0603/100nF/50V  C/0603  [0603]
C33  C0603/22nF/50V  C-EUC0603  [C0603]
C34  C0603/100nF/50V  C/0603  [0603]
C35  1210/4.7uF/100V  C-EUC1210  [C1210]
C36  C0603/100nF/50V  C-EUC0603  [C0603]
C37  C0603/470nF/16V  C/0603  [0603]
C48  1nF  C/0603  [0603]
C49  1nF  C/0603  [0603]
D6  SMBJ43A  SMBJ  [SMB]
E0_ENDSTOP  5PIN_1ROWTHT  [5PIN_1ROW_2.54_THT]
E0_MOTOR  4PIN_1ROWTHT  [4PIN_1ROW_2.54_THT]
R16  R1206,0R15/0.5W  R-EU_R1206  [R1206]
R17  R1206,0R15/0.5W  R-EU_R1206  [R1206]
R18  0603/2R2  R/0603  [0603]
R_PD12  10k  R-EU_R0603  [R0603]
R_PD13  10k  R-EU_R0603  [R0603]
TMC3  TMC5130  [QFP50P900X900X113-49N_NOFID]

### Nets
+5V: C30.1 C48.2 C49.2 E0_ENDSTOP.2 E0_ENDSTOP.4 TMC3.10(VCC_IO) ; also sheet 1,2,3,4,5
CLK: TMC3.2(CLK) ; also sheet 1,3,4,5
CS_E0: TMC3.3(CSN_CFG3) ; also sheet 1
DRV_EN_E0: TMC3.29(DRV_ENN_CFG6) ; also sheet 1
ENDSTOP_E0_LEFT: C49.1 E0_ENDSTOP.5 R_PD12.2 TMC3.8(REFL_STEP)
ENDSTOP_E0_RIGHT: C48.1 E0_ENDSTOP.1 R_PD13.2 TMC3.9(REFR_DIR)
GND: C30.2 C31.2 C34.1 C35.2 C36.1 C37.1 D6.A E0_ENDSTOP.3 R16.1 R17.1 R_PD12.1 R_PD13.1 TMC3.1(TST_MODE) TMC3.6(GND) TMC3.11(SD_MODE) TMC3.13(GNDP) TMC3.23(ENCN_DCO) TMC3.31(GND) TMC3.32(GNDA) TMC3.36(GND) TMC3.48(GNDP) TMC3.PAD(GND_PAD) ; also sheet 1,2,3,4,5
INTERRUPT: TMC3.26(SWN_DIAG0) ; also sheet 1,3,4,5
M1A1_E0: E0_MOTOR.1 TMC3.46(OA1)
M1A2_E0: E0_MOTOR.2 TMC3.42(OA2)
M1B1_E0: E0_MOTOR.3 TMC3.15(OB1)
M1B2_E0: E0_MOTOR.4 TMC3.19(OB2)
MISO: TMC3.7(SDO_NAO_CFG0) ; also sheet 1,2,3,4,5
MOSI: TMC3.5(SDI_NAI_CFG1) ; also sheet 1,2,3,4,5
N$19: C33.1 TMC3.37(CPI)
N$20: C33.2 TMC3.35(CPO)
N$21: C32.2 TMC3.38(VCP)
N$22: C37.2 R18.2 TMC3.34(VCC)
N$23: C31.1 R18.1 TMC3.33(5VOUT)
POSPULSE: TMC3.27(SWP_DIAG1) ; also sheet 1,3,4,5
SCK: TMC3.4(SCK_CFG2) ; also sheet 1,2,3,4,5
SENSE7: R16.2 TMC3.17(BRB)
SENSE8: R17.2 TMC3.44(BRA)
VM: C32.1 C34.2 C35.1 C36.2 D6.C TMC3.21(VS) TMC3.39(VSA) TMC3.40(VS) ; also sheet 1,3,4,5
Unconnected: TMC3.12(SPI_MODE) TMC3.24(ENCB_DCEN_CFG4) TMC3.25(ENCA_DCIN_CFG5) TMC3.28(SWSEL) TMC3.30(AIN_IREF)

## Library data of the parts
AUX-1 AUX-3 SERV_SUPPLY = SparkFun-Connectors:M04X2: .1" header, two rows of four.
AUX-2 = SparkFun-Connectors:M05X2: Header 5x2 Standard 10-pin dual row 0.1" header. Commonly used with AVR-ISP. Use with Spark Fun Electronics SKU: PRT-00778
AUX-4 = SparkFun-Connectors:M18: 1x18 .1" header
C1 C3-C7 C9 C10 C16 C18 C21-C24 C26 C29-C32 C34 C37 C40 C44-C49 = _TMC_TE_RCL:C
C2 C8 C11-C15 C17 C19 C20 C25 C27 C28 C33 C35 C36 C38 C39 C41 = rcl:C-EU: CAPACITOR, European symbol
C42 C43 = rcl:CPOL-EU: POLARIZED CAPACITOR, European symbol
D2 D4-D6 = _TMC_TE_D:SMBJ
D_HB D_HB1 D_HB2 = _TMC_TE_D:MSS1P6: SMT Schottky Barrier Rectifier 1A / 60V
E0_ENDSTOP X_ENDSTOP Y_ENDSTOP Z_ENDSTOP = _TMC_TE_con:5PIN_1ROW
E0_MOTOR X_MOTOR Y_MOTOR Z_MOTOR_1 Z_MOTOR_2 = _TMC_TE_con:4PIN_1ROW
EX_0 FAN HEATBED = TMC5130_ARDUINO_SHIELD:RIA_AKL_220_2_PINS
F1 F2 = TMC5130_ARDUINO_SHIELD:LITTLEFUSE_TR5_383_SERIES
I2C SERVO = SparkFun-Connectors:M04: Header 4 Standard 4-pin 0.1" header. Use with straight break away headers (SKU : PRT-00116), right angle break away headers (PRT-00553), swiss pins (PRT-00743), machine pins (PRT-00117), and female headers (PRT-00115). Molex polarized connector foot print use with SKU : PRT-08231 with associated crimp pins and housings. 1MM SMD Version SKU: PRT-10208
IC1 IC2 IC6 = Jochen_TRI:SN74LVC3G17DCUR
LED1-LED4 LED6 = led:LED: LED OSRAM: - CHIPLED LG R971, LG N971, LY N971, LG Q971, LY Q971, LO R971, LY R971 LH N974, LH R974 LS Q976, LO Q976, LY Q976 LO Q996 - Hyper CHIPLED LW Q18S LB Q993, LB Q99A, LB R99A - SideLED LS A670, LO A670, LY A670, LG A670, LP A670 LB A673, LV A673, LT A673, LW A673 LH A674 LY A675 LS A676, LA A676, LO A676, LY A676, LW A676 LS A679, LY A679, LG A679 - Hyper Micro SIDELED® LS Y876, LA Y876, LO Y876, LY Y876 LT Y87S - SmartLED LW L88C, LW L88S LB L89C, LB L89S, LG L890 LS L89K, LO L89K, LY L89K LS L896, LA L896, LO L896, LY L896 - TOPLED LS T670, LO T670, LY T670, LG T670, LP T670 LSG T670, LSP T670, LSY T670, LOP T670, LYG T670 LG T671, LOG T671, LSG T671 LB T673, LV T673, LT T673, LW T673 LH T674 LS T676, LA T676, LO T676, LY T676, LB T676, LH T676, LSB T676, LW T676 LB T67C, LV T67C, LT T67C, LS T67K, LO T67K, LY T67K, LW E67C LS E67B, LA E67B, LO E67B, LY E67B, LB E67C, LV E67C, LT E67C LW T67C LS T679, LY T679, LG T679 LS T770, LO T770, LY T770, LG T770, LP T770 LB T773, LV T773, LT T773, LW T773 LH T774 LS E675, LA E675, LY E675, LS T675 LS T776, LA T776, LO T776, LY T776, LB T776 LHGB T686 LT T68C, LB T68C - Hyper Mini TOPLED® LB M676 - Mini TOPLED Santana® LG M470 LS M47K, LO M47K, LY M47K Source: http://www.osram.convergy.de LUXEON: - LUMILED® LXK2-PW12-R00, LXK2-PW12-S00, LXK2-PW14-U00, LXK2-PW14-V00 LXK2-PM12-R00, LXK2-PM12-S00, LXK2-PM14-U00 LXK2-PE12-Q00, LXK2-PE12-R00, LXK2-PE12-S00, LXK2-PE14-T00, LXK2-PE14-U00 LXK2-PB12-K00, LXK2-PB12-L00, LXK2-PB12-M00, LXK2-PB14-N00, LXK2-PB14-P00, LXK2-PB14-Q00 LXK2-PR12-L00, LXK2-PR12-M00, LXK2-PR14-Q00, LXK2-PR14-R00 LXK2-PD12-Q00, LXK2-PD12-R00, LXK2-PD12-S00 LXK2-PH12-R00, LXK2-PH12-S00 LXK2-PL12-P00, LXK2-PL12-Q00, LXK2-PL12-R00 Source: www.luxeon.com KINGBRIGHT: KA-3528ASYC Source: www.kingbright.com
MAIN_IN = TMC5130_ARDUINO_SHIELD:RIA_AKL_220_4_PINS
R1-R5 R7-R11 R13 R14 R16 R17 R19-R34 R_PD6-R_PD13 RL2 RL3 = rcl:R-EU_: RESISTOR, European symbol
R6 R12 R15 R18 = _TMC_TE_RCL:R
S1 = switch-omron:10-XX: OMRON SWITCH; MPN: B3F-1000; OC_FARNELL: 176432; OC_NEWARK: 36M3542
SHIELD = TMC5130_ARDUINO_SHIELD:ARDUINO_MEGA_SHIELD_BIG
T1 T7 = Jochen_TRI:BSC010N04LS
T2 = TMC5130_ARDUINO_SHIELD:AON7508
THERM0 THERM1 THERM2 VM0 VM1 = _TMC_TE_con:2PIN_1ROW
TMC1-TMC3 TMC5130 = Trinamic:TMC5130; OC_DIGIKEY: _
XTAL = crystal:SM77H: 3.3V CMOS Clock Oscillator Source: www.pletronics.com .. sm77h%203.3v.pdf; OC_FARNELL: unknown; OC_NEWARK: unknown

## Net classes
2 gnd: width 0.203 mm, drill 0.381 mm, clearance 0.178 mm